# Altium schematic sheet CLKB_clocking_system.SchDoc
size A3
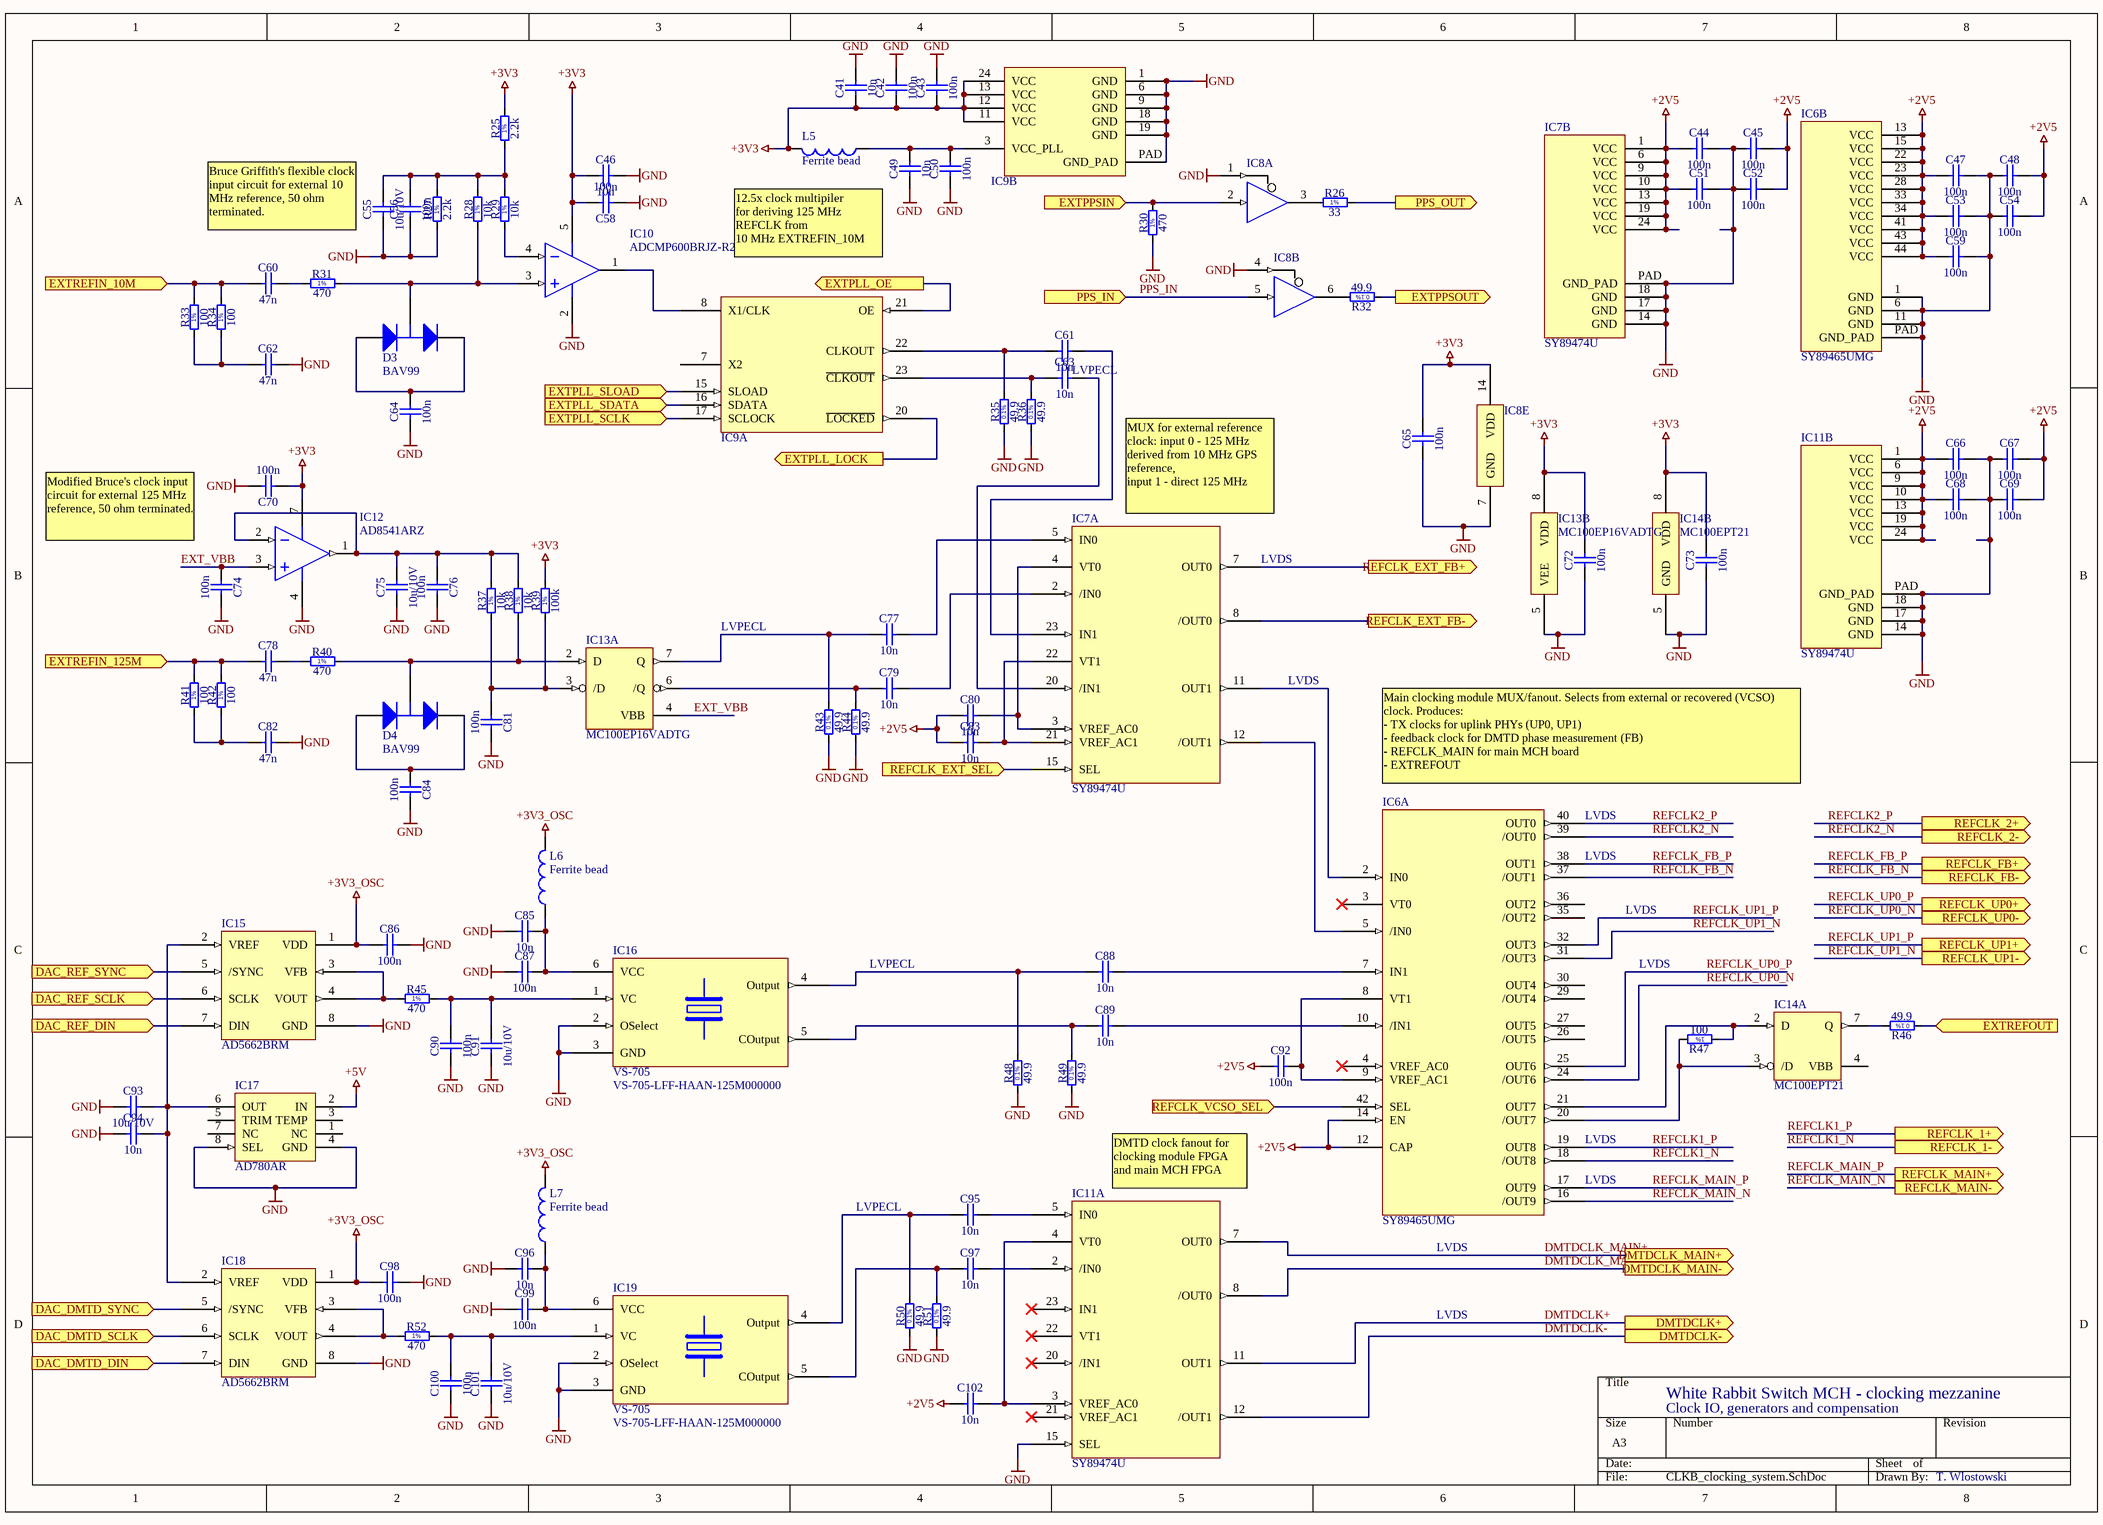
[diagram p0: CLKB_clocking_system.SchDoc]

## Parts
C41  10n  [CAPC1608X87N]
C42  100n  [CAPC1608X87N]
C43  100n  [CAPC1608X87N]
C44  100n  [CAPC1608X87N]
C45  100n  [CAPC1608X87N]
C46  10n  [CAPC1608X87N]
C47  100n  [CAPC1608X87N]
C48  100n  [CAPC1608X87N]
C49  10n  [CAPC1608X87N]
C50  100n  [CAPC1608X87N]
C51  100n  [CAPC1608X87N]
C52  100n  [CAPC1608X87N]
C53  100n  [CAPC1608X87N]
C54  100n  [CAPC1608X87N]
C55  10u/10V  [CAPC3216X140N]
C56  100n  [CAPC1608X87N]
C58  100n  [CAPC1608X87N]
C59  100n  [CAPC1608X87N]
C60  47n  [CAPC1608X87N]
C61  10n  [CAPC1608X87N]
C62  47n  [CAPC1608X87N]
C63  10n  [CAPC1608X87N]
C64  100n  [CAPC1608X87N]
C65  100n  [CAPC1608X87N]
C66  100n  [CAPC1608X87N]
C67  100n  [CAPC1608X87N]
C68  100n  [CAPC1608X87N]
C69  100n  [CAPC1608X87N]
C70  100n  [CAPC1608X87N]
C72  100n  [CAPC1608X87N]
C73  100n  [CAPC1608X87N]
C74  100n  [CAPC1608X87N]
C75  10u/10V  [CAPC3216X140N]
C76  100n  [CAPC1608X87N]
C77  10n  [CAPC1608X87N]
C78  47n  [CAPC1608X87N]
C79  10n  [CAPC1608X87N]
C80  10n  [CAPC1608X87N]
C81  100n  [CAPC1608X87N]
C82  47n  [CAPC1608X87N]
C83  10n  [CAPC1608X87N]
C84  100n  [CAPC1608X87N]
C85  10n  [CAPC1608X87N]
C86  100n  [CAPC1608X87N]
C87  100n  [CAPC1608X87N]
C88  10n  [CAPC1608X87N]
C89  10n  [CAPC1608X87N]
C90  100n  [CAPC1608X87N]
C91  10u/10V  [CAPC3216X140N]
C92  100n  [CAPC1608X87N]
C93  10u/10V  [CAPC3216X140N]
C94  10n  [CAPC1608X87N]
C95  10n  [CAPC1608X87N]
C96  10n  [CAPC1608X87N]
C97  10n  [CAPC1608X87N]
C98  100n  [CAPC1608X87N]
C99  100n  [CAPC1608X87N]
C100  100n  [CAPC1608X87N]
C101  10u/10V  [CAPC3216X140N]
C102  10n  [CAPC1608X87N]
D3  BAV99  [SOT-23]
D4  BAV99  [SOT-23]
IC6  value SY89465UMG  [MLF44]  (hidden comment: SY89465U)  (parts A,B of 2)
IC7  SY89474U  [MLF24]  (parts A,B of 2)
IC8  SN74ALVC125  [SO-14]  (value not drawn)  (parts A,B,E of 5)
IC9  NB4n441  [QFN50P400X400-24W4M]  (value not drawn)  (parts A,B of 2)
IC10  value ADCMP600BRJZ-R2  [SOT23-5AL]  (hidden comment: ADCMP600)
IC11  SY89474U  [MLF24]  (parts A,B of 2)
IC12  value AD8541ARZ  [SOIC127P600-8AL]  (hidden comment: AD8541)
IC13  value MC100EP16VADTG  [TSOP65P490-8AN]  (hidden comment: MC100EP16)  (parts A,B of 2)
IC14  MC100EPT21  [TSOP65P490-8AN]  (parts A,B of 2)
IC15  value AD5662BRM  [TSOP65P490-8AN]  (hidden comment: AD5662B)
IC16  VS-705  value VS-705-LFF-HAAN-125M000000  [VS-705]
IC17  AD780AR  [R-8C_M]
IC18  value AD5662BRM  [TSOP65P490-8AN]  (hidden comment: AD5662B)
IC19  VS-705  value VS-705-LFF-HAAN-125M000000  [VS-705]
L5  Ferrite bead  [INDC2012-0805]
L6  Ferrite bead  [INDC2012-0805]
L7  Ferrite bead  [INDC2012-0805]
R25  2.2k  [RESC1608X55N]
R26  33  [RESC1608X55N]
R27  2.2k  [RESC1608X55N]
R28  10k  [RESC1608X55N]
R29  10k  [RESC1608X55N]
R30  470  [RESC1608X55N]
R31  470  [RESC1608X55N]
R32  49.9  [RESC1608X55N]
R33  100  [RESC1608X55N]
R34  100  [RESC1608X55N]
R35  49.9  [RESC1608X55N]
R36  49.9  [RESC1608X55N]
R37  10k  [RESC1608X55N]
R38  10k  [RESC1608X55N]
R39  100k  [RESC1608X55N]
R40  470  [RESC1608X55N]
R41  100  [RESC1608X55N]
R42  100  [RESC1608X55N]
R43  49.9  [RESC1608X55N]
R44  49.9  [RESC1608X55N]
R45  470  [RESC1608X55N]
R46  49.9  [RESC1608X55N]
R47  100  [RESC1608X55N]
R48  49.9  [RESC1608X55N]
R49  49.9  [RESC1608X55N]
R50  49.9  [RESC1608X55N]
R51  49.9  [RESC1608X55N]
R52  470  [RESC1608X55N]

## Ports
DAC_DMTD_DIN (in), DAC_DMTD_SCLK (in), DAC_DMTD_SYNC (in), DAC_REF_DIN (in), DAC_REF_SCLK (in), DAC_REF_SYNC (in), DMTDCLK+ (out), DMTDCLK- (out), DMTDCLK_MAIN+ (out), DMTDCLK_MAIN- (out), EXTPLL_LOCK (out), EXTPLL_OE (out), EXTPLL_SCLK (in), EXTPLL_SDATA (in), EXTPLL_SLOAD (in), EXTPPSIN (in), EXTPPSOUT (out), EXTREFIN_10M (in), EXTREFIN_125M (in), EXTREFOUT (in), PPS_IN (in), PPS_OUT (out), REFCLK_1+ (out), REFCLK_1- (out), REFCLK_2+ (out), REFCLK_2- (out), REFCLK_EXT_FB+ (out), REFCLK_EXT_FB- (out), REFCLK_EXT_SEL (in), REFCLK_FB+ (out), REFCLK_FB- (out), REFCLK_MAIN+ (out), REFCLK_MAIN- (out), REFCLK_UP0+ (out), REFCLK_UP0- (out), REFCLK_UP1+ (out), REFCLK_UP1- (out), REFCLK_VCSO_SEL (in)

## Nets
+2V5: C44.1 C45.2 C47.1 C48.2 C51.1 C52.2 C53.1 C54.2 C59.1 C66.1 C67.2 C68.1 C69.2 C80.1 C83.1 C92.1 C102.1 IC6.12(CAP) IC6.13(VCC) IC6.14(EN) IC6.15(VCC) IC6.22(VCC) IC6.23(VCC) IC6.28(VCC) IC6.33(VCC) IC6.34(VCC) IC6.41(VCC) IC6.43(VCC) IC6.44(VCC) IC7.1(VCC) IC7.6(VCC) IC7.9(VCC) IC7.10(VCC) IC7.13(VCC) IC7.19(VCC) IC7.24(VCC) IC11.1(VCC) IC11.6(VCC) IC11.9(VCC) IC11.10(VCC) IC11.13(VCC) IC11.19(VCC) IC11.24(VCC)
+3V3: C41.1 C42.1 C43.1 C46.1 C58.2 C65.2 C70.1 C72.2 C73.2 IC8.14(VDD) IC9.11(VCC) IC9.12(VCC) IC9.13(VCC) IC9.24(VCC) IC10.5(VCC/VCCO) IC12.7(V+) IC13.8(VDD) IC14.8(VDD) L5.2 R25.2 R39.2
+3V3_OSC: C86.1 C98.1 IC15.1(VDD) IC18.1(VDD) L6.2 L7.2
+5V: IC17.2(IN)
GND: C41.2 C42.2 C43.2 C44.2 C45.1 C46.2 C47.2 C48.1 C49.1 C50.1 C51.2 C52.1 C53.2 C54.1 C55.1 C56.1 C58.1 C59.2 C62.2 C64.1 C65.1 C66.2 C67.1 C68.2 C69.1 C70.2 C72.1 C73.1 C74.2 C75.1 C76.2 C81.2 C82.2 C84.2 C85.1 C86.2 C87.1 C90.1 C91.1 C93.1 C94.1 C96.1 C98.2 C99.1 C100.1 C101.1 IC6.1(GND) IC6.6(GND) IC6.11(GND) IC6.PAD(GND_PAD) IC7.14(GND) IC7.17(GND) IC7.18(GND) IC7.PAD(GND_PAD) IC8.1(~{A}) IC8.4(~{A}) IC8.7(GND) IC9.1(GND) IC9.6(GND) IC9.9(GND) IC9.18(GND) IC9.19(GND) IC9.PAD(GND_PAD) IC10.2(VEE) IC11.14(GND) IC11.15(SEL) IC11.17(GND) IC11.18(GND) IC11.PAD(GND_PAD) IC12.4(V-) IC13.5(VEE) IC14.5(GND) IC15.8(GND) IC16.2(OSelect) IC16.3(GND) IC17.4(GND) IC17.8(SEL) IC18.8(GND) IC19.2(OSelect) IC19.3(GND) R27.1 R30.1 R35.1 R36.1 R43.1 R44.1 R48.1 R49.1 R50.1 R51.1
DAC_DMTD_DIN: IC18.7(DIN) ; port DAC_DMTD_DIN
DAC_DMTD_SCLK: IC18.6(SCLK) ; port DAC_DMTD_SCLK
DAC_DMTD_SYNC: IC18.5(/SYNC) ; port DAC_DMTD_SYNC
DAC_REF_DIN: IC15.7(DIN) ; port DAC_REF_DIN
DAC_REF_SCLK: IC15.6(SCLK) ; port DAC_REF_SCLK
DAC_REF_SYNC: IC15.5(/SYNC) ; port DAC_REF_SYNC
DMTDCLK+: IC11.11(OUT1) ; port DMTDCLK+
DMTDCLK-: IC11.12(/OUT1) ; port DMTDCLK-
DMTDCLK_MAIN+: IC11.7(OUT0) ; port DMTDCLK_MAIN+
DMTDCLK_MAIN-: IC11.8(/OUT0) ; port DMTDCLK_MAIN-
EXT_VBB: C74.1 IC12.3(IN+) IC13.4(VBB)
EXTPLL_LOCK: IC9.20(~{LOCKED}) ; port EXTPLL_LOCK
EXTPLL_OE: IC9.21(OE) ; port EXTPLL_OE
EXTPLL_SCLK: IC9.17(SCLOCK) ; port EXTPLL_SCLK
EXTPLL_SDATA: IC9.16(SDATA) ; port EXTPLL_SDATA
EXTPLL_SLOAD: IC9.15(SLOAD) ; port EXTPLL_SLOAD
EXTPPSIN: IC8.2(B) R30.2 ; port EXTPPSIN
EXTPPSOUT: R32.1 ; port EXTPPSOUT
EXTREFIN_10M: C60.1 R33.2 R34.2 ; port EXTREFIN_10M
EXTREFIN_125M: C78.1 R41.2 R42.2 ; port EXTREFIN_125M
EXTREFOUT: R46.1 ; port EXTREFOUT
PPS_IN: IC8.5(B) ; port PPS_IN
PPS_OUT: R26.2 ; port PPS_OUT
REFCLK1_N: IC6.18(/OUT8) ; port REFCLK_1-
REFCLK1_P: IC6.19(OUT8) ; port REFCLK_1+
REFCLK2_N: IC6.39(/OUT0) ; port REFCLK_2-
REFCLK2_P: IC6.40(OUT0) ; port REFCLK_2+
REFCLK_EXT_FB+: IC7.7(OUT0) ; port REFCLK_EXT_FB+
REFCLK_EXT_FB-: IC7.8(/OUT0) ; port REFCLK_EXT_FB-
REFCLK_EXT_SEL: IC7.15(SEL) ; port REFCLK_EXT_SEL
REFCLK_FB_N: IC6.37(/OUT1) ; port REFCLK_FB-
REFCLK_FB_P: IC6.38(OUT1) ; port REFCLK_FB+
REFCLK_MAIN_N: IC6.16(/OUT9) ; port REFCLK_MAIN-
REFCLK_MAIN_P: IC6.17(OUT9) ; port REFCLK_MAIN+
REFCLK_UP0_N: IC6.24(/OUT6) ; port REFCLK_UP0-
REFCLK_UP0_P: IC6.25(OUT6) ; port REFCLK_UP0+
REFCLK_UP1_N: IC6.31(/OUT3) ; port REFCLK_UP1-
REFCLK_UP1_P: IC6.32(OUT3) ; port REFCLK_UP1+
REFCLK_VCSO_SEL: IC6.42(SEL) ; port REFCLK_VCSO_SEL
NetC49_2: C49.2 C50.2 IC9.3(VCC_PLL) L5.1
NetC55_2: C55.2 C56.2 R25.1 R27.2 R28.2 R29.2
NetC60_2: C60.2 R31.1
NetC61_1: C61.1 IC9.22(CLKOUT) R35.2
NetC61_2: C61.2 IC7.23(IN1)
NetC62_1: C62.1 R33.1 R34.1
NetC63_1: C63.1 IC9.23(~{CLKOUT}) R36.2
NetC63_2: C63.2 IC7.20(/IN1)
NetC64_2: C64.2 D3.1(A) D3.2(K)
NetC75_2: C75.2 C76.1 IC12.1(OUT) IC12.2(IN-) R37.2 R38.2
NetC77_1: C77.1 IC13.7(Q) R43.2
NetC77_2: C77.2 IC7.5(IN0)
NetC78_2: C78.2 R40.1
NetC79_1: C79.1 IC13.6(/Q) R44.2
NetC79_2: C79.2 IC7.2(/IN0)
NetC80_2: C80.2 IC7.3(VREF_AC0) IC7.4(VT0)
NetC81_1: C81.1 IC13.3(/D) R37.1 R39.1
NetC82_1: C82.1 R41.1 R42.1
NetC83_2: C83.2 IC7.21(VREF_AC1) IC7.22(VT1)
NetC84_1: C84.1 D4.1(A) D4.2(K)
NetC85_2: C85.2 C87.2 IC16.6(VCC) L6.1
NetC88_1: C88.1 IC16.4(Output) R48.2
NetC88_2: C88.2 IC6.7(IN1)
NetC89_1: C89.1 IC16.5(COutput) R49.2
NetC89_2: C89.2 IC6.10(/IN1)
NetC90_2: C90.2 C91.2 IC16.1(VC) R45.2
NetC92_2: C92.2 IC6.8(VT1) IC6.9(VREF_AC1)
NetC93_2: C93.2 C94.2 IC15.2(VREF) IC17.6(OUT) IC18.2(VREF)
NetC95_1: C95.1 IC19.4(Output) R50.2
NetC95_2: C95.2 IC11.5(IN0)
NetC96_2: C96.2 C99.2 IC19.6(VCC) L7.1
NetC97_1: C97.1 IC19.5(COutput) R51.2
NetC97_2: C97.2 IC11.2(/IN0)
NetC100_2: C100.2 C101.2 IC19.1(VC) R52.2
NetC102_2: C102.2 IC11.3(VREF_AC0) IC11.4(VT0)
NetD3_3: D3.3(C) IC10.3(VP) R28.1 R31.2
NetD4_3: D4.3(C) IC13.2(D) R38.1 R40.2
NetIC6_2: IC6.2(IN0) IC7.11(OUT1)
NetIC6_5: IC6.5(/IN0) IC7.12(/OUT1)
NetIC6_20: IC6.20(/OUT7) IC14.3(/D) R47.2
NetIC6_21: IC6.21(OUT7) IC14.2(D) R47.1
NetIC8_3: IC8.3(Y) R26.1
NetIC8_6: IC8.6(Y) R32.2
NetIC9_8: IC9.8(X1/CLK) IC10.1(Q)
NetIC10_4: IC10.4(VN) R29.1
NetIC14_7: IC14.7(Q) R46.2
NetIC15_3: IC15.3(VFB) IC15.4(VOUT) R45.1
NetIC18_3: IC18.3(VFB) IC18.4(VOUT) R52.1

Not connected (* = marked no-connect by the designer): IC6 3(VT0)* 4(VREF_AC0)* 26(/OUT5) 27(OUT5) 29(/OUT4) 30(OUT4) 35(/OUT2) 36(OUT2); IC9 7(X2); IC11 20(/IN1)* 21(VREF_AC1)* 22(VT1)* 23(IN1)*; IC14 4(VBB); IC17 1(NC) 3(TEMP) 5(TRIM) 7(NC)

## Notes on the sheet
- (near C55) Bruce Griffith's flexible clock input circuit for external 10 MHz reference, 50 ohm terminated.
- 12.5x clock multipiler
  for deriving 125 MHz REFCLK from
  10 MHz EXTREFIN_10M
- (near C63) LVPECL
- (near IC7) MUX for external reference clock: input 0 - 125 MHz derived from 10 MHz GPS reference,
  input 1 - direct 125 MHz
- Modified Bruce's clock input circuit for external 125 MHz reference, 50 ohm terminated.
- (near IC7) LVDS
- LVPECL
- LVDS
- (near IC6) Main clocking module MUX/fanout. Selects from external or recovered (VCSO) clock. Produces:
  - TX clocks for uplink PHYs (UP0, UP1)
  - feedback clock for DMTD phase measurement (FB)
  - REFCLK_MAIN for main MCH board
  - EXTREFOUT
- (near IC6) LVDS
- (near IC11) DMTD clock fanout for clocking module FPGA and main MCH FPGA
- White Rabbit Switch MCH - clocking mezzanine
- Clock IO, generators and compensation
- T. Wlostowski
- (in symbol R0603_2K2_1%_0.1W_100PPM) 1%
- (in symbol R0603_10K_1%_0.1W_100PPM) 1%
- (in symbol R0603_33R_1%_0.1W_100PPM) 1%
- (in symbol R0603_49R9_0.1%_0.063W_10PPM) 0.1%
- (in symbol R0603_100K_1%_0.1W_100PPM) 1%
- (in symbol R0603_100R_1%_0.1W_100PPM) 1%
- (in symbol R0603_470R_1%_0.1W_100PPM) 1%

## Library data of the parts
C41 C46 C49 C61 C63 C77 C79 C80 C83 C85 C88 C89 C94-C97 C102 = CC0603_10NF_50V_10%_X7R: Non-polarised capacitor; Part Description: SMD Multilayer Chip Ceramic Capacitor; Manufacturer: GENERIC; Manufacturer1 Part Number: 223858615636; Manufacturer1 Datasheet: \\cern.ch\dfs\Applications\Altium\Datasheets\CC0603_X7R_PHYCOMP.pdf; Value: 10nF; Voltage: 50V; TC: X7R; Tolerance: ±10%; Table: Capacitors SMD; Part Number: CC0603_10NF_50V_10%_X7R; Component Kind: Standard; Component Type: Standard; Designator: Capacitor - non polarized; Library Reference: Capacitor - non polarized; Pin Count: 2; Status: Preferred; Manufacturer Part Number: CC0603_10NF_50V_10%_X7R; Case: 0603; Mounted: Yes; Socket: No; SMD: Yes; Manufacturer1 Example: PHYCOMP; Manufacturer1 ComponentHeight: 0.87mm; HelpURL: \\cern.ch\dfs\Applications\Altium\Datasheets\CC0603_X7R_PHYCOMP.pdf; Author: CERN DEM JLC; CreateDate: 12/3/2007; LatestRevisionDate: 12/3/2007
C42-C45 C47 C48 C50-C54 C56 C58 C59 C64-C70 C72-C74 C76 C81 C84 C86 C87 C90 C92 C98-C100 = CC0603_100NF_50V_10%_X7R: Non-polarised capacitor; Part Description: SMD Multilayer Chip Ceramic Capacitor; Manufacturer: GENERIC; Manufacturer1 Part Number: 223858615649; Manufacturer1 Datasheet: \\cern.ch\dfs\Applications\Altium\Datasheets\CC0603_X7R_PHYCOMP.pdf; Value: 100nF; Voltage: 50V; TC: X7R; Tolerance: ±10%; Table: Capacitors SMD; Part Number: CC0603_100NF_50V_10%_X7R; Component Kind: Standard; Component Type: Standard; Designator: Capacitor - non polarized; Library Reference: Capacitor - non polarized; Pin Count: 2; Status: Preferred; Manufacturer Part Number: CC0603_100NF_50V_10%_X7R; Case: 0603; Mounted: Yes; Socket: No; SMD: Yes; Manufacturer1 Example: PHYCOMP; Manufacturer1 ComponentHeight: 0.87mm; HelpURL: \\cern.ch\dfs\Applications\Altium\Datasheets\CC0603_X7R_PHYCOMP.pdf; Author: CERN DEM JLC; CreateDate: 12/3/2007; LatestRevisionDate: 12/3/2007
C55 C75 C91 C93 C101 = CC1206_10UF_10V_10%_X7R: Non-polarised capacitor; Part Description: SMD Multilayer Chip Ceramic Capacitor; Manufacturer: GENERIC; Manufacturer1 Part Number: C1206C106K8RAC; Manufacturer1 Datasheet: \\cern.ch\dfs\Applications\Altium\Datasheets\CC1206_X7R_KEMET.pdf; Value: 10uF; Voltage: 10V; TC: X7R; Tolerance: ±10%; Table: Capacitors SMD; Part Number: CC1206_10UF_10V_10%_X7R; Component Kind: Standard; Component Type: Standard; Designator: Capacitor - non polarized; Library Reference: Capacitor - non polarized; Pin Count: 2; Status: Preferred; Manufacturer Part Number: CC1206_10uF_10V_10%_X7R; Case: 1206; Mounted: Yes; Socket: No; SMD: Yes; Manufacturer1 Example: KEMET; Manufacturer1 ComponentHeight: 1.8mm; HelpURL: \\cern.ch\dfs\Applications\Altium\Datasheets\CC1206_X7R_KEMET.pdf; Author: CERN DEM JLC; CreateDate: 12/3/2007; LatestRevisionDate: 12/3/2007
C60 C62 C78 C82 = CC0603_47NF_25V_10%_X7R: Non-polarised capacitor; Part Description: SMD Multilayer Chip Ceramic Capacitor; Manufacturer: GENERIC; Manufacturer1 Part Number: 223891615645; Manufacturer1 Datasheet: \\cern.ch\dfs\Applications\Altium\Datasheets\CC0603_X7R_PHYCOMP.pdf; Value: 47nF; Voltage: 25V; TC: X7R; Tolerance: ±10%; Table: Capacitors SMD; Part Number: CC0603_47NF_25V_10%_X7R; Component Kind: Standard; Component Type: Standard; Designator: Capacitor - non polarized; Library Reference: Capacitor - non polarized; Pin Count: 2; Status: Preferred; Manufacturer Part Number: CC0603_47NF_25V_10%_X7R; Case: 0603; Mounted: Yes; Socket: No; SMD: Yes; Manufacturer1 Example: PHYCOMP; Manufacturer1 ComponentHeight: 0.87mm; HelpURL: \\cern.ch\dfs\Applications\Altium\Datasheets\CC0603_X7R_PHYCOMP.pdf; Author: CERN DEM JLC; CreateDate: 12/3/2007; LatestRevisionDate: 12/3/2007
D3 D4 = BAV99: Silicon Switching Diode Array for High-Speed Switching; RefId: 1081211; Published: 21-Mar-2003; DatasheetDocument: Oct-1999; PackageDocument: Sep-2001; PackageReference: SOT-23; Publisher: Altium Limited; ComponentLink1Description: Manufacturer Link; ComponentLink1URL: http://www.infineon.com/; ComponentLink2Description: Datasheet; ComponentLink2URL: http://www.infineon.com/upload/Document/cmc_upload/documents/080/631/bav99series_1.pdf; Supplier: Farnell; Value: BAV99
IC6 = SY89465U: Micrel 2:10 any->LVDS clock fanout; RefId: 576-1476-1-ND; Supplier: Digikey
IC7 IC11 = SY89474U: 2:1 differential clock mux/2-output fanout; RefId: 576-2562-ND; Supplier: Digikey; Value: SY89474U
IC8 = SN74ALVC125: Quad Buffer with 3-State Outputs with TTL Compatible Inputs; Value: SN74ALVC125
IC9 = NB4n441: OnSemi single-chip clock synthesizer; Value: NB3N3020DTR2G; RefId: NB3N3020DTR2G-ND; Supplier: Digikey
IC10 = ADCMP600: Analog Devices fast comparator; RefId: 1441023; Supplier: Farnell
IC12 = AD8541: Analog Devices general purpose low-voltage R2R CMOS opamp; RefId: 9603859; Supplier: Farnell
IC13 = MC100EP16: ONSemi differental receiver w/ECL output; RefId: 1607606; Supplier: Farnell
IC14 = MC100EPT21: ONSemi LVDS/LVPECL -> LVTTL/LVCMOS buffer; RefId: MC100EPT21DTGOS-ND; Supplier: Digikey; Value: MC100EPT21
IC15 IC18 = AD5662: Analog Devices 16-bit DAC w/SPI interface, ext ref; RefId: 1117908; Supplier: Farnell
IC16 IC19 = VS-705: Vectron Voltage Controlled SAW Oscillator; Supplier: Vectron (?)
  IC16: RefID: VS-705-LFF-HAAN-125M000000
IC17 = AD780AR: 2.5V/3.0V High-Precision Reference; Note: Pins 1 and 7 are not connected; Value: AD780ARZ; RefId: AD780ARZ-ND; Published: 8-Jun-2000; LatestRevisionDate: 13-Apr-2006; LatestRevisionNote: IPC-7351 Footprint Added.; DatasheetVersion: REV. A; PackageVersion: revC; PackageReference: R-8C; Publisher: Altium Limited; PackageDescription: 8-Pin Small Outline Integrated Circuit 1.27 mm Pitch; Code_IPC: SOIC127P600-8; ComponentLink1Description: Manufacturer Link; ComponentLink1URL: http://www.analog.com/en/prod/0,,769_838_AD780%2C00.html; ComponentLink2Description: Datasheet; ComponentLink2URL: http://www.analog.com/UploadedFiles/Data_Sheets/87683462AD780_e.pdf; Supplier: Digikey
L5-L7 = Inductor: Code_IEC: 1005; Published: 8-Jun-2000; LatestRevisionDate: 17-Jul-2002; LatestRevisionNote: Re-released for DXP Platform.; PackageReference: 0402-A; Publisher: Altium Limited; Code_JEITA: 0402
R25 R27 = R0603_2K2_1%_0.1W_100PPM: Resistor - 1%; Part Description: General Purpose Thick Film Chip Resistor; Manufacturer: GENERIC; Manufacturer1 Part Number: NRC06F2201TRF; Manufacturer1 Datasheet: \\cern.ch\dfs\Applications\Altium\Datasheets\R0603_NIC_NRC.pdf; Value: 2k2; Power: 0.1W; TC: ±100ppm/°C; Table: Resistors SMD; Part Number: R0603_2K2_1%_0.1W_100PPM; Component Kind: Standard; Component Type: Standard; Designator: Resistor - 1%; Library Reference: Resistor - 1%; Pin Count: 2; Status: Preferred; Tolerance: ±1%; Manufacturer Part Number: R0603_2K2_1%_0.1W_100PPM; Case: 0603; Mounted: Yes; Socket: No; SMD: Yes; Manufacturer1 Example: NIC COMPONENT; Manufacturer1 ComponentHeight: 0.55mm; HelpURL: \\cern.ch\dfs\Applications\Altium\Datasheets\R0603_NIC_NRC.pdf; Author: CERN DEM JLC; CreateDate: 12/3/2007; LatestRevisionDate: 3/13/2008
R26 = R0603_33R_1%_0.1W_100PPM: Resistor - 1%; Part Description: General Purpose Thick Film Chip Resistor; Manufacturer: GENERIC; Manufacturer1 Part Number: NRC06F33R0TRF; Manufacturer1 Datasheet: \\cern.ch\dfs\Applications\Altium\Datasheets\R0603_NIC_NRC.pdf; Power: 0.1W; TC: ±100ppm/°C; Table: Resistors SMD; Part Number: R0603_33R_1%_0.1W_100PPM; Component Kind: Standard; Component Type: Standard; Designator: Resistor - 1%; Library Reference: Resistor - 1%; Pin Count: 2; Value: 33; Status: Preferred; Tolerance: ±1%; Manufacturer Part Number: R0603_33R_1%_0.1W_100PPM; Case: 0603; Mounted: Yes; Socket: No; SMD: Yes; Manufacturer1 Example: NIC COMPONENT; Manufacturer1 ComponentHeight: 0.55mm; HelpURL: \\cern.ch\dfs\Applications\Altium\Datasheets\R0603_NIC_NRC.pdf; Author: CERN DEM JLC; CreateDate: 12/3/2007; LatestRevisionDate: 3/13/2008
R28 R29 R37 R38 = R0603_10K_1%_0.1W_100PPM: Resistor - 1%; Part Description: General Purpose Thick Film Chip Resistor; Manufacturer: GENERIC; Manufacturer1 Part Number: NRC06F1002TRF; Manufacturer1 Datasheet: \\cern.ch\dfs\Applications\Altium\Datasheets\R0603_NIC_NRC.pdf; Power: 0.1W; TC: ±100ppm/°C; Table: Resistors SMD; Part Number: R0603_10K_1%_0.1W_100PPM; Component Kind: Standard; Component Type: Standard; Designator: Resistor - 1%; Library Reference: Resistor - 1%; Pin Count: 2; Value: 10k; Status: Preferred; Tolerance: ±1%; Manufacturer Part Number: R0603_10K_1%_0.1W_100PPM; Case: 0603; Mounted: Yes; Socket: No; SMD: Yes; Manufacturer1 Example: NIC COMPONENT; Manufacturer1 ComponentHeight: 0.55mm; HelpURL: \\cern.ch\dfs\Applications\Altium\Datasheets\R0603_NIC_NRC.pdf; Author: CERN DEM JLC; CreateDate: 12/3/2007; LatestRevisionDate: 3/13/2008
R30 R31 R40 R45 R52 = R0603_470R_1%_0.1W_100PPM: Resistor - 1%; Part Description: General Purpose Thick Film Chip Resistor; Manufacturer: GENERIC; Manufacturer1 Part Number: NRC06F4700TRF; Manufacturer1 Datasheet: \\cern.ch\dfs\Applications\Altium\Datasheets\R0603_NIC_NRC.pdf; Power: 0.1W; TC: ±100ppm/°C; Table: Resistors SMD; Part Number: R0603_470R_1%_0.1W_100PPM; Component Kind: Standard; Component Type: Standard; Designator: Resistor - 1%; Library Reference: Resistor - 1%; Pin Count: 2; Value: 470; Status: Preferred; Tolerance: ±1%; Manufacturer Part Number: R0603_470R_1%_0.1W_100PPM; Case: 0603; Mounted: Yes; Socket: No; SMD: Yes; Manufacturer1 Example: NIC COMPONENT; Manufacturer1 ComponentHeight: 0.55mm; HelpURL: \\cern.ch\dfs\Applications\Altium\Datasheets\R0603_NIC_NRC.pdf; Author: CERN DEM JLC; CreateDate: 12/3/2007; LatestRevisionDate: 3/13/2008
R32 R35 R36 R43 R44 R46 R48-R51 = R0603_49R9_0.1%_0.063W_10PPM: Resistor - 0.1%; Part Description: Thin Film Chip Resistor; Manufacturer: GENERIC; Manufacturer1 Part Number: RN73C1J49R9BTDF; Manufacturer1 Datasheet: \\cern.ch\dfs\Applications\Altium\Datasheets\R0603_Tyco_RN73.pdf; Value: 49R9; Power: 0.063W; TC: ±10ppm; Table: Resistors SMD; Part Number: R0603_49R9_0.1%_0.063W_10PPM; Component Kind: Standard; Component Type: Standard; Designator: Resistor - 0.1%; Library Reference: Resistor - 0.1%; Pin Count: 2; Status: Not recommended; Tolerance: ±0.1%; Manufacturer Part Number: R0603_49R9_0.1%_0.063W_10PPM; Case: 0603; Mounted: Yes; Socket: No; SMD: Yes; Manufacturer1 Example: TYCO HOLSWORTHY; Manufacturer1 ComponentHeight: 0.5mm; HelpURL: \\cern.ch\dfs\Applications\Altium\Datasheets\R0603_Tyco_RN73.pdf; Author: CERN DEM JLC; CreateDate: 12/3/2007; LatestRevisionDate: 3/13/2008
R33 R34 R41 R42 R47 = R0603_100R_1%_0.1W_100PPM: Resistor - 1%; Part Description: General Purpose Thick Film Chip Resistor; Manufacturer: GENERIC; Manufacturer1 Part Number: NRC06F4700TRF; Manufacturer1 Datasheet: \\cern.ch\dfs\Applications\Altium\Datasheets\R0603_NIC_NRC.pdf; Power: 0.1W; TC: ±100ppm/°C; Table: Resistors SMD; Part Number: R0603_100R_1%_0.1W_100PPM; Component Kind: Standard; Component Type: Standard; Designator: Resistor - 1%; Library Reference: Resistor - 1%; Pin Count: 2; Value: 100; Status: Preferred; Tolerance: ±1%; Manufacturer Part Number: R0603_100R_1%_0.1W_100PPM; Case: 0603; Mounted: Yes; Socket: No; SMD: Yes; Manufacturer1 Example: NIC COMPONENT; Manufacturer1 ComponentHeight: 0.55mm; HelpURL: \\cern.ch\dfs\Applications\Altium\Datasheets\R0603_NIC_NRC.pdf; Author: CERN DEM JLC; CreateDate: 12/3/2007; LatestRevisionDate: 3/13/2008
R39 = R0603_100K_1%_0.1W_100PPM: Resistor - 1%; Part Description: General Purpose Thick Film Chip Resistor; Manufacturer: GENERIC; Manufacturer1 Part Number: NRC06F1003TRF; Manufacturer1 Datasheet: \\cern.ch\dfs\Applications\Altium\Datasheets\R0603_NIC_NRC.pdf; Power: 0.1W; TC: ±100ppm/°C; Table: Resistors SMD; Part Number: R0603_100K_1%_0.1W_100PPM; Component Kind: Standard; Component Type: Standard; Designator: Resistor - 1%; Library Reference: Resistor - 1%; Pin Count: 2; Value: 100k; Status: Preferred; Tolerance: ±1%; Manufacturer Part Number: R0603_100K_1%_0.1W_100PPM; Case: 0603; Mounted: Yes; Socket: No; SMD: Yes; Manufacturer1 Example: NIC COMPONENT; Manufacturer1 ComponentHeight: 0.55mm; HelpURL: \\cern.ch\dfs\Applications\Altium\Datasheets\R0603_NIC_NRC.pdf; Author: CERN DEM JLC; CreateDate: 12/3/2007; LatestRevisionDate: 3/13/2008